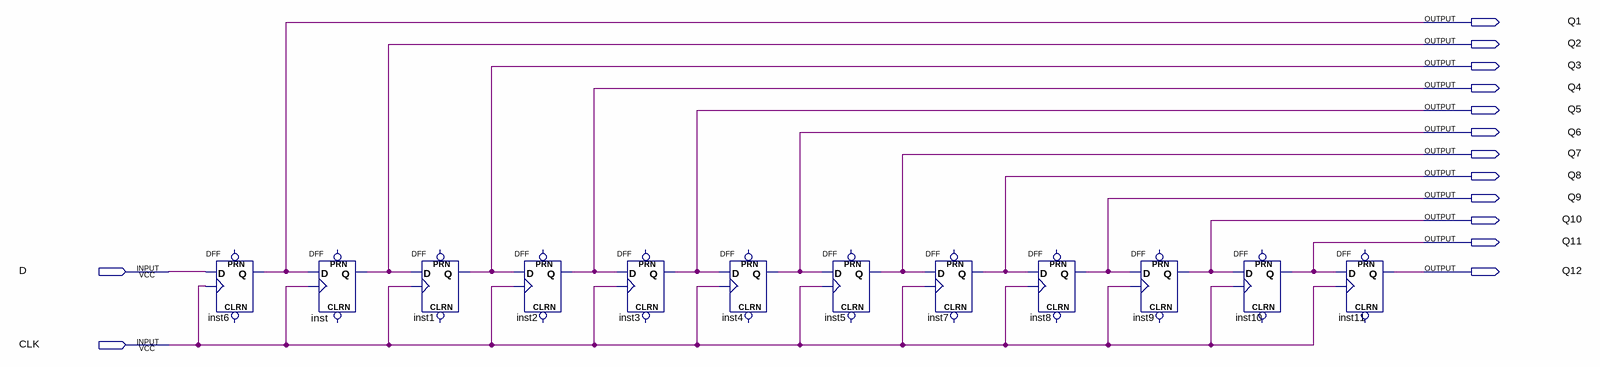
[diagram p0: schematic sheet]
// Quartus schematic Lab1.bdf as structural Verilog: 12 symbols, 14 pins
module Lab1 (
  input  D,
  input  CLK,
  output Q1,
  output Q2,
  output Q3,
  output Q4,
  output Q5,
  output Q6,
  output Q7,
  output Q8,
  output Q9,
  output Q10,
  output Q11,
  output Q12
);

  DFF inst6 (.CLK(CLK), .D(D), .Q(Q1));  // open: CLRN, PRN
  DFF inst (.CLK(CLK), .D(Q1), .Q(Q2));  // open: CLRN, PRN
  DFF inst1 (.CLK(CLK), .D(Q2), .Q(Q3));  // open: CLRN, PRN
  DFF inst2 (.CLK(CLK), .D(Q3), .Q(Q4));  // open: CLRN, PRN
  DFF inst3 (.CLK(CLK), .D(Q4), .Q(Q5));  // open: CLRN, PRN
  DFF inst4 (.CLK(CLK), .D(Q5), .Q(Q6));  // open: CLRN, PRN
  DFF inst5 (.CLK(CLK), .D(Q6), .Q(Q7));  // open: CLRN, PRN
  DFF inst7 (.CLK(CLK), .D(Q7), .Q(Q8));  // open: CLRN, PRN
  DFF inst8 (.CLK(CLK), .D(Q8), .Q(Q9));  // open: CLRN, PRN
  DFF inst9 (.CLK(CLK), .D(Q9), .Q(Q10));  // open: CLRN, PRN
  DFF inst10 (.CLK(CLK), .D(Q10), .Q(Q11));  // open: CLRN, PRN
  DFF inst11 (.CLK(CLK), .D(Q11), .Q(Q12));  // open: CLRN, PRN
endmodule
